# EAGLE schematic Паяльник2 (EAGLE 7.5.0)

## Sheet 1 of 2
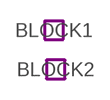
[diagram p0: schematic, sheet 1]

### Module instances
BLOCK1 = MAIN-PAYALNIK-T2
BLOCK2 = T12-CPU

## Sheet 2 of 2
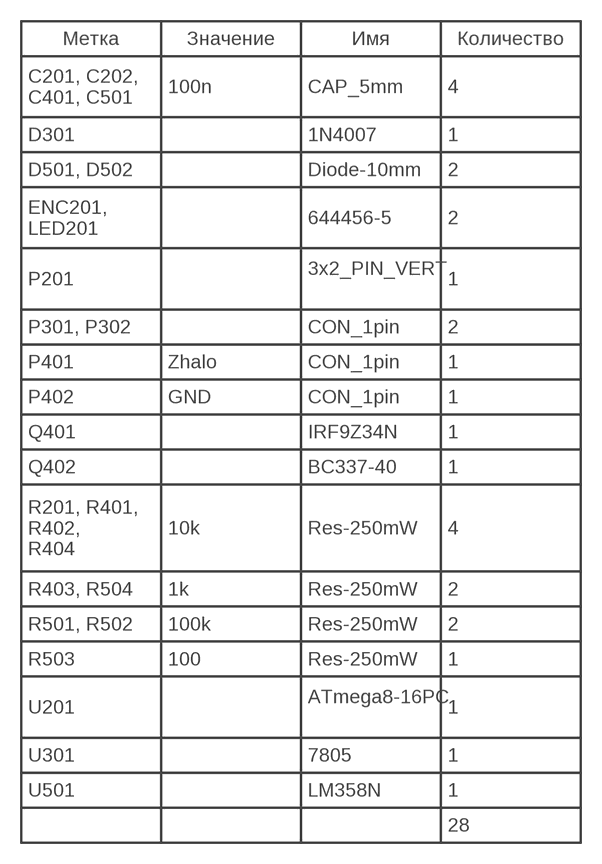
[diagram p1: schematic, sheet 2]

### Notes on the sheet
- Метка | Значение | Имя | Количество
- C201, C202,
  C401, C501
- 100n | CAP_5mm | 4
- D301 | 1N4007 | 1
- D501, D502 | Diode-10mm | 2
- ENC201,
  LED201
- 644456-5 | 2
- P201 | 3x2_PIN_VERT | 1
- P301, P302 | CON_1pin | 2
- P401 | Zhalo | CON_1pin | 1
- P402 | GND | CON_1pin | 1
- Q401 | IRF9Z34N | 1
- Q402 | BC337-40 | 1
- R201, R401,
  R402,
  R404
- 10k | Res-250mW | 4
- R403, R504 | 1k | Res-250mW | 2
- R501, R502 | 100k | Res-250mW | 2
- R503 | 100 | Res-250mW | 1
- U201 | ATmega8-16PC | 1
- U301 | 7805 | 1
- U501 | LM358N | 1
- 28

## Library data of the parts

## Module T12-MOSFET
Ports: +25V_D(io) +25V(io) Tip_S(io) GND_A(io)
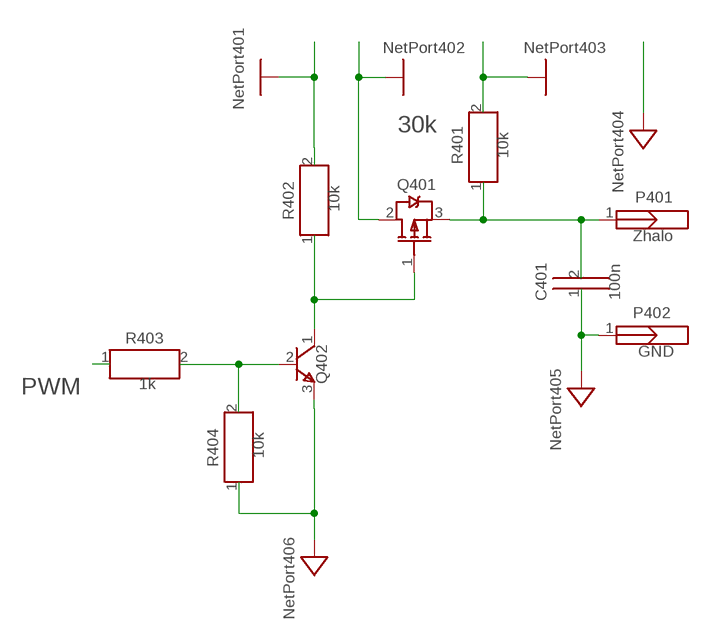
[diagram p2: schematic, module T12-MOSFET, sheet 1]

### Parts
C401  100n  CAP_5MM  [CAP-5.08/5.1x2.5]
P401  Zhalo  CON_1PIN  [1PIN]
P402  GND  CON_1PIN  [1PIN]
Q401  IRF9Z34N  [TO-220]
Q402  BC337-40  [TO-92]
R401  10k  RES-250MW_2  [RES-10.35/6.8x2.8]
R402  10k  RES-250MW_2  [RES-10.35/6.8x2.8]
R403  1k  RES-250MW  [RES-10.35/6.8x2.8]
R404  10k  RES-250MW_2  [RES-10.35/6.8x2.8]

### Nets
+25V: Q401.2(D)
+25V_D: R402.2(B)
GND_A: C401.1 P402.1 Q402.3(E) R404.1(A) ; supply symbol labelled GND_ANALOG
Net_4: Q401.1(G) Q402.1(C) R402.1(A)
Net_6: Q402.2(B) R403.2(B) R404.2(B)
Net_17: C401.2 P401.1 Q401.3(S) R401.1(A)
PWM: R403.1(A)
Tip_S: R401.2(B) ; supply symbol labelled TIP_S

### Notes on the sheet
- 30k
- PWM

### Library data of the parts
C401 = common:CAP_5MM
P401 P402 = common:CON_1PIN; ATTR_1: Male; ATTR_2: Plug; DESCRIPTION: Contact
Q401 = common:IRF9Z34N; MANUFACTURER: IR
Q402 = common:BC337-40; DATASHEET: http://datasheets.diptrace.com/motorola/BC337_8.pdf; MANUFACTURER: Motorola
R401 R402 R404 = common:RES-250MW_2
R403 = common:RES-250MW; VALUE: 10k

## Module POWER-T12
Ports: +25V(io) +25V_D(io) +5V(io) GND_A(io)
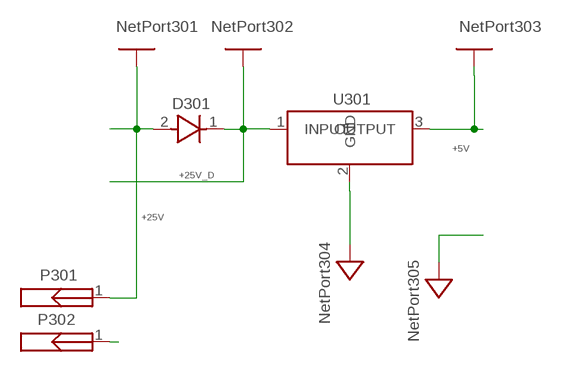
[diagram p3: schematic, module POWER-T12, sheet 1]

### Parts
D301  1N4007  [DO-41]
P301  CON_1PIN  [1PIN]
P302  CON_1PIN  [1PIN]
U301  7805  [TO-220]

### Nets
+5V: U301.3(OUTPUT)
+25V: D301.2(A) P301.1
+25V_D: D301.1(K) U301.1(INPUT)
GND_A: P302.1 U301.2(GND) ; supply symbol labelled GND_ANALOG

### Library data of the parts
D301 = common:1N4007
P301 P302 = common:CON_1PIN; ATTR_1: Male; ATTR_2: Plug; DESCRIPTION: Contact
U301 = common:7805; MANUFACTURER: Atmel

## Module ANALOG-LM358
Ports: Tip_S(io) +5V(io) GND_A(io)
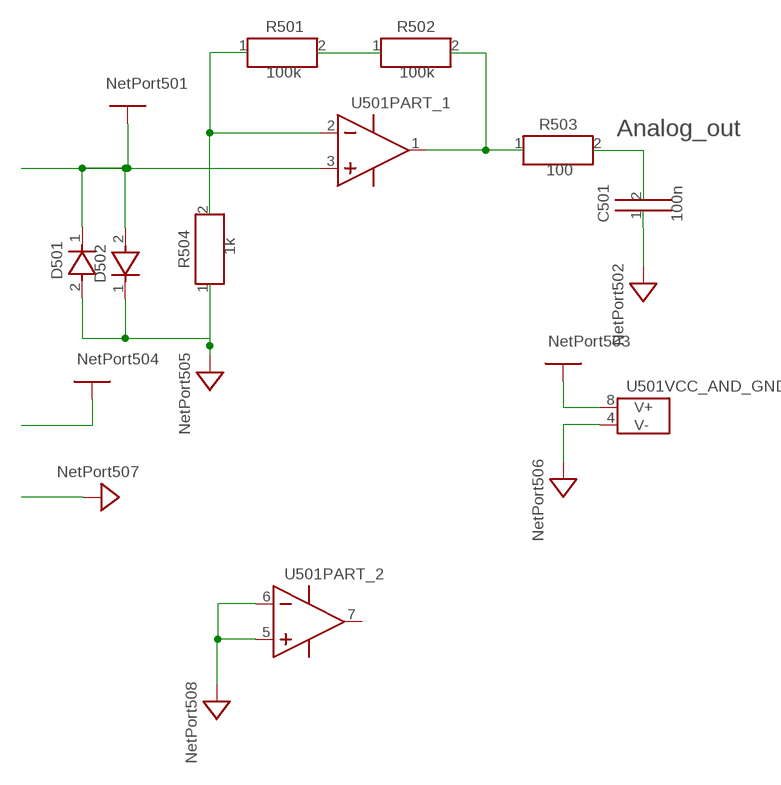
[diagram p4: schematic, module ANALOG-LM358, sheet 1]

### Parts
C501  100n  CAP_5MM  [CAP-5.08/5.1x2.5]
D501  DIODE-10MM  [R-1]
D502  DIODE-10MM  [R-1]
R501  100k  RES-250MW  [RES-10.35/6.8x2.8]
R502  100k  RES-250MW  [RES-10.35/6.8x2.8]
R503  100  RES-250MW  [RES-10.35/6.8x2.8]
R504  1k  RES-250MW_2  [RES-10.35/6.8x2.8]
U501  LM358N  [DIP-8]

### Nets
+5V: U501.8(VCC_AND_GND:V+)
GND_A: C501.1 D501.2(A) D502.1(K) R504.1(A) U501.4(VCC_AND_GND:V-) U501.5(PART_2:IN+) U501.6(PART_2:IN-) ; supply symbol labelled GND_ANALOG
LM358-analog: C501.2 R503.2(B)
Net_19: R501.1(A) R504.2(B) U501.2(PART_1:IN-)
Net_20: R502.2(B) R503.1(A) U501.1(PART_1:OUT)
Tip_S: D501.1(K) D502.2(A) U501.3(PART_1:IN+) ; supply symbol labelled TIP_S
Сеть_24: R501.2(B) R502.1(A)
Unconnected: U501.7(PART_2:OUT)

### Notes on the sheet
- Analog_out

### Library data of the parts
C501 = common:CAP_5MM
D501 D502 = common:DIODE-10MM
R501-R503 = common:RES-250MW; VALUE: 10k
R504 = common:RES-250MW_2; VALUE: 10k
U501 = common:LM358N; DATASHEET: http://datasheets.diptrace.com/motorola/LM158_258_358_2904.pdf; MANUFACTURER: Motorola

## Module MAIN-PAYALNIK-T2
Ports: 
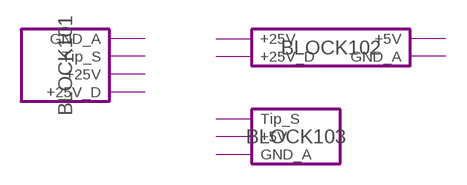
[diagram p5: schematic, module MAIN-PAYALNIK-T2, sheet 1]

### Module instances
BLOCK101 = T12-MOSFET
BLOCK102 = POWER-T12
BLOCK103 = ANALOG-LM358

### Library data of the parts

## Module T12-CPU
Ports: 
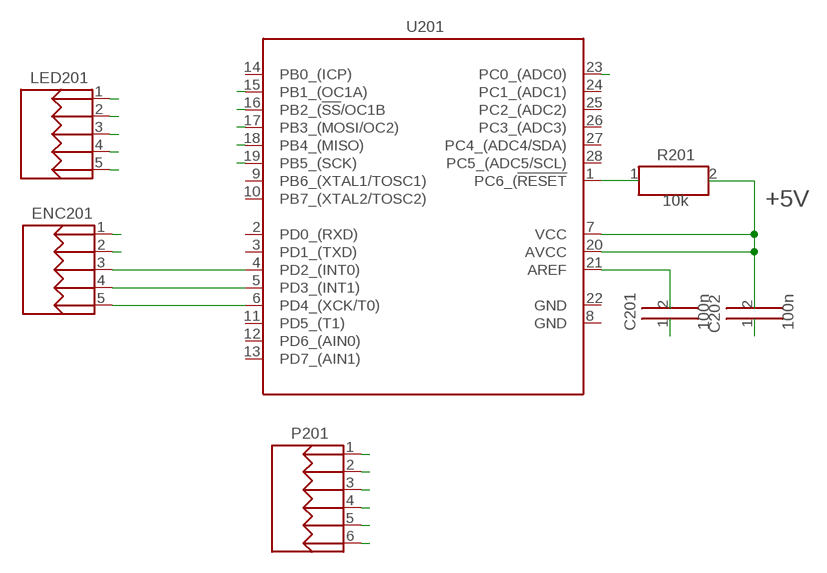
[diagram p6: schematic, module T12-CPU, sheet 1]

### Parts
C201  100n  CAP_5MM  [CAP-5.08/5.1x2.5]
C202  100n  CAP_5MM  [CAP-5.08/5.1x2.5]
ENC201  644456-5  [HDR-1x5T/2.54/12x2]
LED201  644456-5  [HDR-1x5T/2.54/12x2]
P201  3X2_PIN_VERT  [HDR-2x3T/2.54x2.54/8x5]
R201  10k  RES-250MW  [RES-10.35/6.8x2.8]
U201  ATMEGA8-16PC  [DIP-28]

### Nets
+5V: C202.2 ENC201.2 LED201.2 P201.2 R201.2(B) U201.7(VCC) U201.20(AVCC)
Clk: LED201.4 U201.16(PB2_(!SS!/OC1B)
GND_A: C201.1 C202.1 ENC201.1 LED201.1 P201.6
LM358-analog: U201.23(PC0_(ADC0))
Miso: LED201.3 P201.1 U201.18(PB4_(MISO))
Mosi: LED201.5 P201.4 U201.17(PB3_(MOSI/OC2))
PWM: U201.15(PB1_(OC1A))
Reset: P201.5 R201.1(A) U201.1(PC6_(!RESET)
Sck: P201.3 U201.19(PB5_(SCK))
Сеть_3: ENC201.3 U201.4(PD2_(INT0))
Сеть_4: ENC201.4 U201.5(PD3_(INT1))
Сеть_5: ENC201.5 U201.6(PD4_(XCK/T0))
Сеть_27: C201.2 U201.21(AREF)
Unconnected: U201.2(PD0_(RXD)) U201.3(PD1_(TXD)) U201.9(PB6_(XTAL1/TOSC1)) U201.10(PB7_(XTAL2/TOSC2)) U201.11(PD5_(T1)) U201.12(PD6_(AIN0)) U201.13(PD7_(AIN1)) U201.14(PB0_(ICP)) U201.24(PC1_(ADC1)) U201.25(PC2_(ADC2)) U201.26(PC3_(ADC3)) U201.27(PC4_(ADC4/SDA)) U201.28(PC5_(ADC5/SCL))

### Notes on the sheet
- +5V

### Power pins joined to a net without a drawn wire
GND: U201.8(GND) U201.22(GND)

### Library data of the parts
C201 C202 = common:CAP_5MM
ENC201 LED201 = common:644456-5; DATASHEET: http://datasheets.diptrace.com/con_headers/ENG_CD_644456_D2.pdf; MANUFACTURER: TE Connectivity
P201 = common:3X2_PIN_VERT; DATASHEET: http://datasheets.diptrace.com\con_headers\901310126_sd.pdf; MANUFACTURER: Molex
R201 = common:RES-250MW
U201 = common:ATMEGA8-16PC; MANUFACTURER: Atmel

## Net classes
1 kicad_default: width 0.254 mm, clearance 0.254 mm
2 NetClass2: width 0.5 mm